# Altium schematic sheet Microcontroller.SchDoc
size 431 x 279 mm; ApprovedBy: UDEMY; CheckedBy: Siz Değerli Öğrenciler; Revision: AA; SheetNumber: 4; SheetTotal: 5; PreparedBy: Mustafa Berk AYDOĞAN; ProjectDescription: Wireless Security
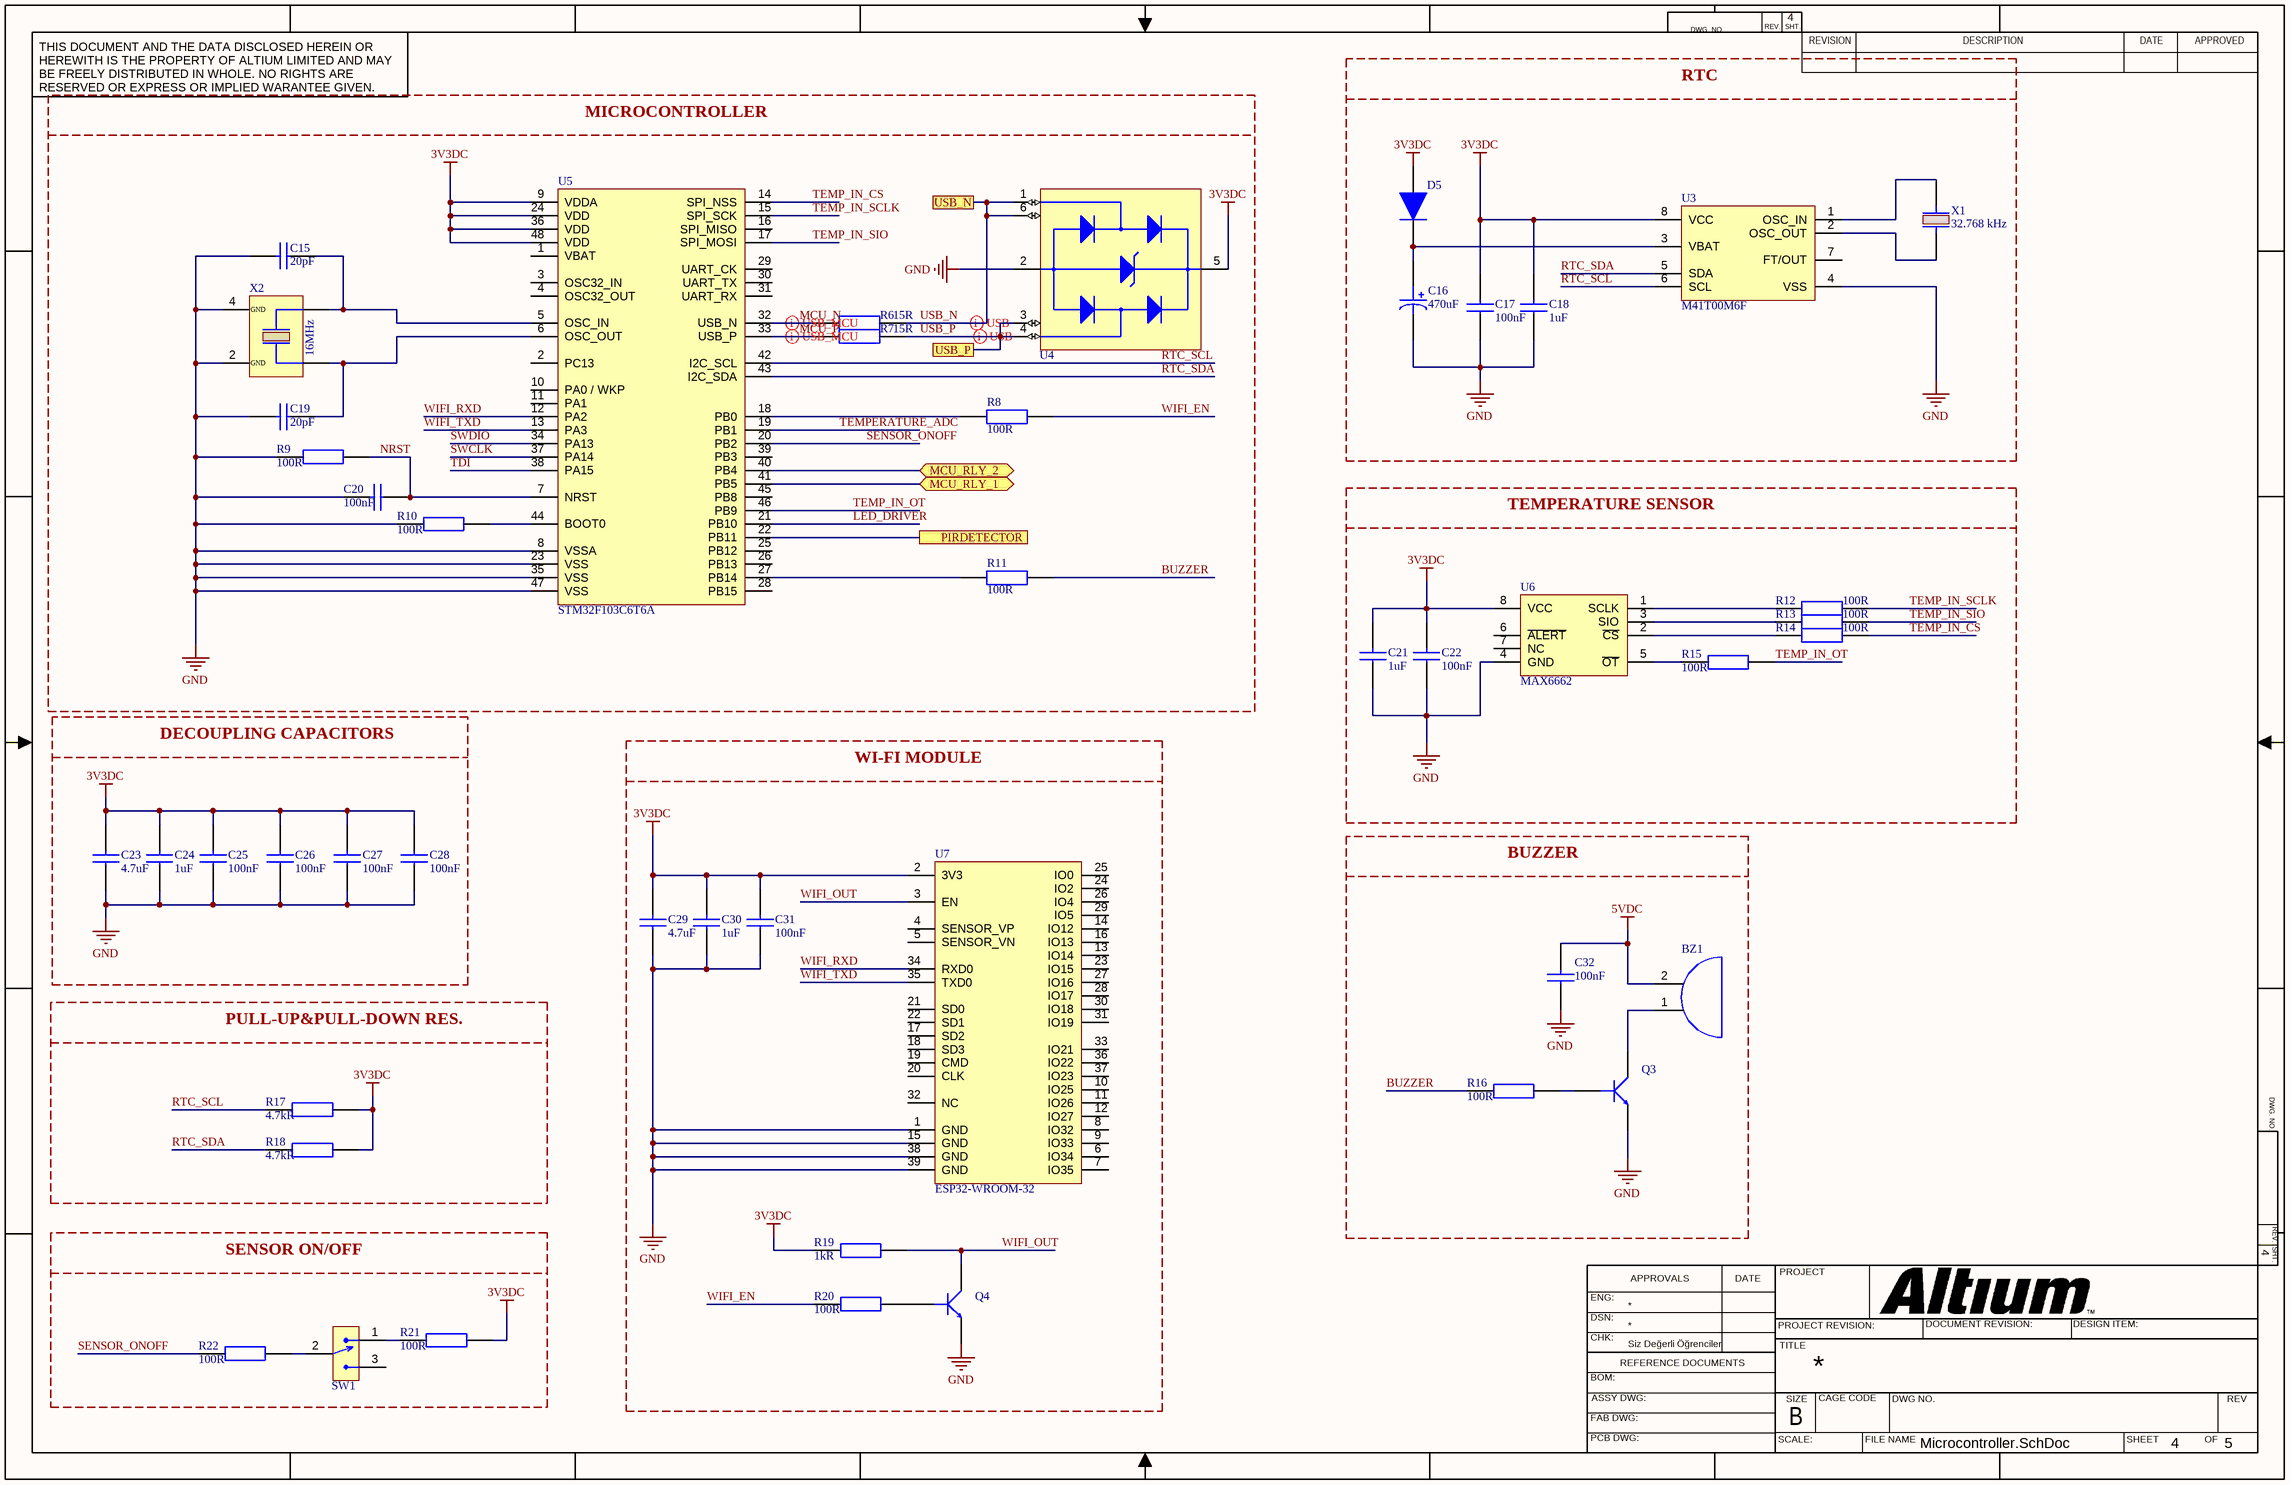
[diagram p0: Microcontroller.SchDoc]

## Parts
BZ1  CMI-9605IC-0580T  [CMI-9605IC]  (value not drawn)
C15  Capacitance: 20pF  [CAP_0603]  (hidden comment: CL10C200JB8NNNC)
C16  Capacitance: 470uF  [CAP_RADIAL_D10_P5]  (hidden comment: ESH477M050AH4AA)
C17  Capacitance: 100nF  [CAP_0805]  (hidden comment: CL21B104KBCNNNC)
C18  Capacitance: 1uF  [CAP_0805]  (hidden comment: CL21B105KBFNNNE)
C19  Capacitance: 20pF  [CAP_0603]  (hidden comment: CL10C200JB8NNNC)
C20  Capacitance: 100nF  [CAP_0603]  (hidden comment: C0603C104K5RACTU)
C21  Capacitance: 1uF  [CAP_0805]  (hidden comment: CL21B105KBFNNNE)
C22  Capacitance: 100nF  [CAP_0805]  (hidden comment: CL21B104KBCNNNC)
C23  Capacitance: 4.7uF  [CAP_0805]  (hidden comment: CL21A475KAQNNNE)
C24  Capacitance: 1uF  [CAP_0805]  (hidden comment: CL21B105KBFNNNE)
C25  Capacitance: 100nF  [CAP_0603]  (hidden comment: C0603C104K5RACTU)
C26  Capacitance: 100nF  [CAP_0603]  (hidden comment: C0603C104K5RACTU)
C27  Capacitance: 100nF  [CAP_0603]  (hidden comment: C0603C104K5RACTU)
C28  Capacitance: 100nF  [CAP_0603]  (hidden comment: C0603C104K5RACTU)
C29  Capacitance: 4.7uF  [CAP_0805]  (hidden comment: CL21A475KAQNNNE)
C30  Capacitance: 1uF  [CAP_0805]  (hidden comment: CL21B105KBFNNNE)
C31  Capacitance: 100nF  [CAP_0805]  (hidden comment: CL21B104KBCNNNC)
C32  Capacitance: 100nF  [CAP_0805]  (hidden comment: CL21B104KBCNNNC)
D5  1N4148WS  [SOD323F]  (value not drawn)
Q3  MMBT3904-7-F  [SOT-23F]  (value not drawn)
Q4  MMBT3904-7-F  [SOT-23F]  (value not drawn)
R6  Resistance: 15R  [RES_0603]  (hidden comment: RC0603JR-0715RL)
R7  Resistance: 15R  [RES_0603]  (hidden comment: RC0603JR-0715RL)
R8  Resistance: 100R  [RES_0603]  (hidden comment: RC0603JR-07100RL)
R9  Resistance: 100R  [RES_0603]  (hidden comment: RC0603JR-07100RL)
R10  Resistance: 100R  [RES_0603]  (hidden comment: RC0603JR-07100RL)
R11  Resistance: 100R  [RES_0603]  (hidden comment: RC0603JR-07100RL)
R12  Resistance: 100R  [RES_0603]  (hidden comment: RC0603JR-07100RL)
R13  Resistance: 100R  [RES_0603]  (hidden comment: RC0603JR-07100RL)
R14  Resistance: 100R  [RES_0603]  (hidden comment: RC0603JR-07100RL)
R15  Resistance: 100R  [RES_0603]  (hidden comment: RC0603JR-07100RL)
R16  Resistance: 100R  [RES_0603]  (hidden comment: RC0603JR-07100RL)
R17  Resistance: 4.7kR  [RES_0603]  (hidden comment: RC0603JR-074K7L)
R18  Resistance: 4.7kR  [RES_0603]  (hidden comment: RC0603JR-074K7L)
R19  Resistance: 1kR  [RES_0603]  (hidden comment: RC0603FR-0710KL)
R20  Resistance: 100R  [RES_0603]  (hidden comment: RC0603JR-07100RL)
R21  Resistance: 100R  [RES_0603]  (hidden comment: RC0603JR-07100RL)
R22  Resistance: 100R  [RES_0603]  (hidden comment: RC0603JR-07100RL)
SW1  EG1215AA  [EG1215AA]  (value not drawn)
U3  M41T00M6F  [SOIC8]
U4  USBLC6-2SC6  [SOT23-6L]  (value not drawn)
U5  STM32F103C6T6A  [LQFP-48]
U6  MAX6662  [SOIC8]
U7  ESP32-WROOM-32  [ESP32-32]
X1  Operating Frequency: 32.768 kHz  [ABS05]  (hidden comment: ABS05-32.768KHZ-T)
X2  Frequency: 16MHz  [ECS]  (hidden comment: ECS-160-20-30B-TR)

## Blocks framed on the sheet
MICROCONTROLLER: C15 C19 C20 R6-R11 U4 U5 X2
RTC: C16-C18 D5 U3 X1
TEMPERATURE SENSOR: C21 C22 R12-R15 U6
DECOUPLING CAPACITORS: C23-C28
WI-FI MODULE: C29-C31 Q4 R19 R20 U7
BUZZER: BZ1 C32 Q3 R16
PULL-UP&PULL-DOWN RES.: R17 R18
SENSOR ON/OFF: R21 R22 SW1

## Ports
MCU_RLY_1 (bidir), MCU_RLY_2 (bidir), PIRDETECTOR, USB_N, USB_P

## Nets
3V3DC: C17.2 C18.2 C21.2 C22.2 C23.2 C24.2 C25.2 C26.2 C27.2 C28.2 C29.2 C30.2 C31.2 D5.2 R17.2 R18.2 R19.2 R21.2 U3.8(VCC) U4.5(VBUS) U5.9(VDDA) U5.24(VDD) U5.36(VDD) U5.48(VDD) U6.8(VCC) U7.2(3V3)
5VDC: BZ1.2 C32.2
GND: C15.2 C16.2 C17.1 C18.1 C19.2 C20.2 C21.1 C22.1 C23.1 C24.1 C25.1 C26.1 C27.1 C28.1 C29.1 C30.1 C31.1 C32.1 Q3.2(E) Q4.2(E) R9.1 R10.1 U3.4(VSS) U4.2(GND) U5.8(VSSA) U5.23(VSS) U5.35(VSS) U5.47(VSS) U6.4(GND) U7.1(GND) U7.15(GND) U7.38(GND) U7.39(GND) X2.2(GND) X2.4(GND)
BUZZER: R11.2 R16.1
LED_DRIVER: U5.21(PB10)
MCU_N: R6.1 U5.32(USB_N)
MCU_P: R7.1 U5.33(USB_P)
MCU_RLY_1: U5.41(PB5) ; port MCU_RLY_1
MCU_RLY_2: U5.40(PB4) ; port MCU_RLY_2
NRST: C20.1 R9.2 U5.7(NRST)
PIRDETECTOR: U5.22(PB11) ; port PIRDETECTOR
RTC_SCL: R17.1 U3.6(SCL) U5.42(I2C_SCL)
RTC_SDA: R18.1 U3.5(SDA) U5.43(I2C_SDA)
SENSOR_ONOFF: R22.2 U5.20(PB2)
SWCLK: U5.37(PA14)
SWDIO: U5.34(PA13)
TDI: U5.38(PA15)
TEMP_IN_CS: R14.2 U5.14(SPI_NSS)
TEMP_IN_OT: R15.2 U5.46(PB9)
TEMP_IN_SCLK: R12.2 U5.15(SPI_SCK)
TEMP_IN_SIO: R13.2 U5.17(SPI_MOSI)
TEMPERATURE_ADC: U5.19(PB1)
USB_N: R6.2 U4.1(I/O1) U4.6(I/O1) ; port USB_N
USB_P: R7.2 U4.3(I/O2) U4.4(I/O2) ; port USB_P
WIFI_EN: R8.2 R20.1
WIFI_OUT: Q4.3(C) R19.1 U7.3(EN)
WIFI_RXD: U5.12(PA2) U7.34(RXD0)
WIFI_TXD: U5.13(PA3) U7.35(TXD0)
NetBZ1_1: BZ1.1 Q3.3(C)
NetC15_1: C15.1 U5.5(OSC_IN) X2.3
NetC16_1: C16.1 D5.1 U3.3(VBAT)
NetC19_1: C19.1 U5.6(OSC_OUT) X2.1
NetQ3_1: Q3.1(B) R16.2
NetQ4_1: Q4.1(B) R20.2
NetR8_1: R8.1 U5.18(PB0)
NetR10_2: R10.2 U5.44(BOOT0)
NetR11_1: R11.1 U5.27(PB14)
NetR12_1: R12.1 U6.1(SCLK)
NetR13_1: R13.1 U6.3(SIO)
NetR14_1: R14.1 U6.2(~{CS})
NetR15_1: R15.1 U6.5(~{OT})
NetR21_1: R21.1 SW1.1
NetR22_1: R22.1 SW1.2
NetU3_1: U3.1(OSC_IN) X1.2
NetU3_2: U3.2(OSC_OUT) X1.1

Not connected (* = marked no-connect by the designer): SW1 3; U3 7(FT/OUT); U5 1(VBAT) 2(PC13) 3(OSC32_IN) 4(OSC32_OUT) 10(PA0_/_WKP) 11(PA1) 16(SPI_MISO) 25(PB12) 26(PB13) 28(PB15) 29(UART_CK) 30(UART_TX) 31(UART_RX) 39(PB3) 45(PB8); U6 6(~{ALERT}) 7(NC); U7 4(SENSOR_VP) 5(SENSOR_VN) 6(IO34) 7(IO35) 8(IO32) 9(IO33) 10(IO25) 11(IO26) 12(IO27) 13(IO14) 14(IO12) 16(IO13) 17(SD2) 18(SD3) 19(CMD) 20(CLK) 21(SD0) 22(SD1) 23(IO15) 24(IO2) 25(IO0) 26(IO4) 27(IO16) 28(IO17) 29(IO5) 30(IO18) 31(IO19) 32(NC) 33(IO21) 36(IO22) 37(IO23)

## Layout directives
differential pair: MCU_N, MCU_P, USB_N, USB_P

## Notes on the sheet
- DWG. NO.
- REV.
- SHT.
- THIS DOCUMENT AND THE DATA DISCLOSED HEREIN OR HEREWITH IS THE PROPERTY OF ALTIUM LIMITED AND MAY BE FREELY DISTRIBUTED IN WHOLE. NO RIGHTS ARE RESERVED OR EXPRESS OR IMPLIED WARANTEE GIVEN.
- REVISION
- DESCRIPTION
- DATE
- APPROVED
- ENG:
- APPROVALS
- PROJECT
- DSN:
- CHK:
- REFERENCE DOCUMENTS
- PROJECT REVISION:
- TITLE
- DOCUMENT REVISION:
- DESIGN ITEM:
- BOM:
- FAB DWG:
- PCB DWG:
- ASSY DWG:
- SCALE:
- SIZE
- B
- CAGE CODE
- FILE NAME
- DWG NO.
- SHEET
- OF
- REV

## Library data of the parts
BZ1 = CMI-9605IC-0580T: Buzzers Indicator, Internally Driven Magnetic 5V 30mA 2.7kHz 80dB @ 5V, 10cm Through Hole PC Pins; Manufacturer: CUI Devices; Designed by: BERK; Supplier 1: Digi-Key; Manufacturer Part Number: CMI-9605IC-0580T; RoHS: No; Stock 1: 1663; Pricing 1: 1=1,41000, 10=1,17900, 25=1,09080, 50=1,02680, 100=0,96490, 500=0,83018, 1000=0,77805 (USD); Supplier Part Number 1: 2223-CMI-9605IC-0580T-ND; Case/Package: CMI-9605IC
C15 C19 = CAP CER 20pF 0603: CAP CER 20pF %5 0603 SMD; Manufacturer: Samsung; Tolerance: 5%; Dielectric: C0G; Voltage Rating: 50V; Temperature Coefficient: 300ppm/°C; Designed by: BERK; Supplier 1: Digi-Key; Manufacturer Part Number: CL10C200JB8NNNC; RoHS: Yes; Category: Ceramic Capacitors; Stock 1: 765558; Pricing 1: 1=0,10000, 10=0,04700, 50=0,02560, 100=0,02090, 500=0,01490, 1000=0,01171 (USD); Mount: Surface Mount; Case/Package: 0603; Case Code (Metric): 1608; Case Code (Imperial): 0603; Min Operating Temperature: -55°C; Max Operating Temperature: 125°C; Package Quantity: 1; Packaging: Tape and Reel; Voltage: 50V; Series: CL; Construction: Flat; Length: 1.6mm; Width: 0.031inch; Height: 0.8mm; Thickness: 0.035inch; Depth: 0.8mm; Radiation Hardening: No; RoHS Compliant: Yes; ComponentLink1URL: https://datasheet.ciiva.com/26877/getdatasheetpartid-640634-26877974.pdf?src-supplier=Verical; ComponentLink1Description: https://datasheet.ciiva.com/26877/getdatasheetpartid-640634-26877974.pdf?src-supplier=Verical; ComponentLink2URL: https://datasheet.ciiva.com/26310/mlcc-catalogdownload2013-eng-26310315.pdf?src-supplier=Distrelec; ComponentLink2Description: https://datasheet.ciiva.com/26310/mlcc-catalogdownload2013-eng-26310315.pdf?src-supplier=Distrelec; Supplier Part Number 1: 1276-1187-1-ND
C16 = CAP ALU ELEC 470uF 50V: CAP ALU ELEC 470uF 50V RADIAL; Manufacturer: KEMET; Designed by: BERK; Polarity: Polar; Tolerance: 20%; Life (Hours): 2000Hour; Supplier 1: Digi-Key; Manufacturer Part Number: ESH477M050AH4AA; RoHS: No; Stock 1: 1181; Pricing 1: 1=0,59000, 10=0,41700, 50=0,31540, 100=0,27470, 500=0,20350, 1000=0,17298, 2500=0,16280, 5000=0,15262 (USD); Mount: Through Hole; Case/Package: Radial; Min Operating Temperature: -40°C; Max Operating Temperature: 105°C; Packaging: Bulk; Voltage Rating: 50V; RoHS Compliant: No; ComponentLink1URL: https://api.kemet.com/component-edge/download/datasheet/ESH477M050AH4AA.pdf?src-supplier=Digi-Key; ComponentLink1Description: https://api.kemet.com/component-edge/download/datasheet/ESH477M050AH4AA.pdf?src-supplier=Digi-Key; Supplier Part Number 1: 399-15683-ND
C17 C22 C31 C32 = CAP CER 100nF 0805: CAP CER 100nF %10 0805; Manufacturer: Samsung; Designed by: BERK; Material: Ceramic; Tolerance: 10%; Dielectric: X7R; Voltage Rating: 50V; Supplier 1: Digi-Key; Manufacturer Part Number: CL21B104KBCNNNC; RoHS: Yes; Category: Ceramic Capacitors; Stock 1: 3371502; Pricing 1: 1=0,10000, 10=0,04700, 50=0,02560, 100=0,02090, 500=0,01494, 1000=0,01174 (USD); Mount: Surface Mount; Case/Package: 0805; Case Code (Metric): 2012; Case Code (Imperial): 0805; Contact Plating: Tin; Min Operating Temperature: -55°C; Max Operating Temperature: 125°C; Packaging: Tape and Reel; Voltage: 50V; Voltage Rating (DC): 50V; Series: CL; Construction: Flat; Length: 2mm; Width: 0.049inch; Height: 0.85mm; Depth: 1.25mm; Thickness: 0.037inch; Radiation Hardening: No; Lead Free: Lead Free; RoHS Compliant: Yes; ComponentLink1URL: https://datasheet.ciiva.com/25710/cl21b104kbcnnnc-25710182.pdf?src-supplier=Digi-Key; ComponentLink1Description: https://datasheet.ciiva.com/25710/cl21b104kbcnnnc-25710182.pdf?src-supplier=Digi-Key; ComponentLink2URL: https://datasheet.ciiva.com/29199/454152-da-01-en-vs-kondensator-0805-29199814.pdf?src-supplier=Conrad; ComponentLink2Description: https://datasheet.ciiva.com/29199/454152-da-01-en-vs-kondensator-0805-29199814.pdf?src-supplier=Conrad; Supplier Part Number 1: 1276-1003-1-ND
C18 C21 C24 C30 = CAP CER 1uF 0805: CAP CER 1uF %10 0805; Manufacturer: Samsung; Designed by: BERK; Tolerance: 10%; Voltage Rating: 50V; Dielectric: X7R; Supplier 1: Digi-Key; Manufacturer Part Number: CL21B105KBFNNNE; RoHS: Yes; Category: Ceramic Capacitors; Stock 1: 958000; Pricing 1: 2000=0,02138, 4000=0,01956 (USD); Mount: Surface Mount; Case/Package: 0805; Case Code (Metric): 2012; Case Code (Imperial): 0805; Min Operating Temperature: -55°C; Max Operating Temperature: 125°C; Packaging: Tape and Reel; Package Quantity: 1; Voltage: 50V; Series: CL; Construction: Flat; Length: 2mm; Width: 0.049inch; Height: 1.25mm; Thickness: 0.053inch; Depth: 1.25mm; Radiation Hardening: No; RoHS Compliant: Yes; ComponentLink1URL: https://datasheet.ciiva.com/25800/cl21b105kbfnnne-25800291.pdf?src-supplier=Digi-Key; ComponentLink1Description: https://datasheet.ciiva.com/25800/cl21b105kbfnnne-25800291.pdf?src-supplier=Digi-Key; ComponentLink2URL: https://datasheet.ciiva.com/16449/cl21b105kbfnnne-16449003.pdf?src-supplier=Future+Electronics; ComponentLink2Description: https://datasheet.ciiva.com/16449/cl21b105kbfnnne-16449003.pdf?src-supplier=Future+Electronics; ComponentLink3URL: https://datasheet.ciiva.com/26838/getdatasheetpartid-354075-26838668.pdf?src-supplier=Verical; ComponentLink3Description: https://datasheet.ciiva.com/26838/getdatasheetpartid-354075-26838668.pdf?src-supplier=Verical; Supplier Part Number 1: 1276-1029-2-ND
C20 C25-C28 = CAP CER 100nF 0603: CAP CER 100nF %10 0603 SMD; Manufacturer: KEMET; Designed by: BERK; Dielectric Material: Ceramic; Voltage Rating (DC): 50V; Tolerance: 10%; Dielectric: X7R; Dissipation Factor: 2.5%; Supplier 1: Digi-Key; Manufacturer Part Number: C0603C104K5RACTU; RoHS: Yes; Category: Ceramic Capacitors; Stock 1: 1666186; Pricing 1: 1=0,12000, 10=0,08500, 50=0,04620, 100=0,03770, 500=0,02696, 1000=0,02118 (USD); Mount: Surface Mount; Case/Package: 0603; Number of Pins: 2; Case Code (Metric): 1608; Case Code (Imperial): 0603; Contact Plating: Tin,Matte; Min Operating Temperature: -55°C; Max Operating Temperature: 125°C; Packaging: Tape and Reel; Package Quantity: 1; Termination: SMD/SMT; Voltage: 50V; Voltage Rating: 50V; Series: SMD Comm X7R; Length: 0.063inch; Width: 0.031inch; Height: 0.8mm; Thickness: 0.034inch; Lead Pitch: 0.7mm; Depth: 0.8mm; Radiation Hardening: No; RoHS Compliant: Yes; REACH SVHC: No SVHC; ComponentLink1URL: https://datasheet.ciiva.com/7823/kem-c1002-x7r-smd-7823591.pdf?src-supplier=Element14; ComponentLink1Description: https://datasheet.ciiva.com/7823/kem-c1002-x7r-smd-7823591.pdf?src-supplier=Element14; ComponentLink2URL: https://datasheet.ciiva.com/14602/70095383-14602583.pdf?src-supplier=Allied+Electronics; ComponentLink2Description: https://datasheet.ciiva.com/14602/70095383-14602583.pdf?src-supplier=Allied+Electronics; ComponentLink3URL: https://datasheet.ciiva.com/5999/kem-c1002-x7r-smd-5999400.pdf?src-supplier=Farnell; ComponentLink3Description: https://datasheet.ciiva.com/5999/kem-c1002-x7r-smd-5999400.pdf?src-supplier=Farnell; ComponentLink4URL: https://datasheet.ciiva.com/7823/kem-c1002-x7r-smd-7823592.pdf?src-supplier=Element14; ComponentLink4Description: https://datasheet.ciiva.com/7823/kem-c1002-x7r-smd-7823592.pdf?src-supplier=Element14; ComponentLink5URL: https://datasheet.ciiva.com/28645/1851736-28645640.pdf?src-supplier=Element14; ComponentLink5Description: https://datasheet.ciiva.com/28645/1851736-28645640.pdf?src-supplier=Element14; ComponentLink6URL: https://datasheet.ciiva.com/14585/70095383-14585209.pdf?src-supplier=Allied+Electronics; ComponentLink6Description: https://datasheet.ciiva.com/14585/70095383-14585209.pdf?src-supplier=Allied+Electronics; Supplier Part Number 1: 399-5089-1-ND
C23 C29 = CAP CER 4.7uF 0805: CAP CER 4.7uF %10 0805; Manufacturer: Samsung; Tolerance: 10%; Voltage Rating: 25V; Dielectric: X5R; Designed by: BERK; Supplier 1: Digi-Key; Manufacturer Part Number: CL21A475KAQNNNE; RoHS: Yes; Category: Ceramic Capacitors; Stock 1: 1477018; Pricing 1: 1=0,11000, 10=0,08100, 50=0,04580, 100=0,03800, 500=0,02664, 1000=0,02205 (USD); Mount: Surface Mount; Case/Package: 0805; Case Code (Metric): 2012; Case Code (Imperial): 0805; Min Operating Temperature: -55°C; Max Operating Temperature: 85°C; Package Quantity: 1; Packaging: Tape and Reel; Voltage Rating (DC): 25V; Series: CL; Construction: Flat; Length: 2mm; Width: 0.049inch; Height: 1.25mm; Thickness: 0.055inch; Depth: 1.25mm; Radiation Hardening: No; Lead Free: Lead Free; RoHS Compliant: Yes; ComponentLink1URL: https://datasheet.ciiva.com/25798/cl21a475kaqnnne-25798882.pdf?src-supplier=Digi-Key; ComponentLink1Description: https://datasheet.ciiva.com/25798/cl21a475kaqnnne-25798882.pdf?src-supplier=Digi-Key; Supplier Part Number 1: 1276-1244-1-ND
D5 = 1N4148WS: Diode, Single, 75 V, 150 mA, 1 V, 4 ns; Manufacturer: ON Semiconductor / Fairchild; Designed by: BERK; Forward Current: 150mA; Reverse Recovery Time: 4ns; Max Repetitive Reverse Voltage (Vrrm): 75V; Power Dissipation: 200mW; Max Reverse Current: 5uA; Forward Voltage: 1V; Max Forward Surge Current (Ifsm): 2A; Supplier 1: Digi-Key; Manufacturer Part Number: 1N4148WS; RoHS: Yes; Category: Rectifier Diodes; Stock 1: 79118; Pricing 1: 1=0,17000, 10=0,12100, 100=0,06530, 500=0,05128, 1000=0,03562 (USD); Mount: Surface Mount; Number of Pins: 2; Contact Plating: Tin,Matte; Weight: 0.0276g; Min Operating Temperature: -55°C; Max Operating Temperature: 150°C; Packaging: Tape and Reel; Package Quantity: 1; Recovery Time: 4ns; Average Rectified Current: 150mA; Element Configuration: Single; Reverse Voltage: 75V; Max Reverse Voltage (DC): 75V; Series: -; Length: 1.8mm; Width: 1.35mm; Height: 1mm; Radiation Hardening: No; REACH SVHC: No SVHC; Lead Free: Lead Free; RoHS Compliant: Yes; ComponentLink1URL: https://datasheet.ciiva.com/25968/1n914bws-25968945.pdf?src-supplier=Avnet+Europe; ComponentLink1Description: https://datasheet.ciiva.com/25968/1n914bws-25968945.pdf?src-supplier=Avnet+Europe; ComponentLink2URL: https://datasheet.ciiva.com/30479/0900766b810e1cd3-30479206.pdf?src-supplier=RSComponents; ComponentLink2Description: https://datasheet.ciiva.com/30479/0900766b810e1cd3-30479206.pdf?src-supplier=RSComponents; ComponentLink3URL: https://datasheet.ciiva.com/910/1n4148ws-910381.pdf?src-supplier=Digi-Key; ComponentLink3Description: https://datasheet.ciiva.com/910/1n4148ws-910381.pdf?src-supplier=Digi-Key; ComponentLink4URL: https://datasheet.ciiva.com/15208/getdatasheetpartid-127819-15208358.pdf?src-supplier=Verical; ComponentLink4Description: https://datasheet.ciiva.com/15208/getdatasheetpartid-127819-15208358.pdf?src-supplier=Verical; ComponentLink5URL: https://datasheet.ciiva.com/8300/1n914bws-8300360.pdf?src-supplier=Avnet; ComponentLink5Description: https://datasheet.ciiva.com/8300/1n914bws-8300360.pdf?src-supplier=Avnet; ComponentLink6URL: https://datasheet.ciiva.com/910/1n4148ws-910380.pdf?src-supplier=Digi-Key; ComponentLink6Description: https://datasheet.ciiva.com/910/1n4148ws-910380.pdf?src-supplier=Digi-Key; ComponentLink7URL: https://datasheet.ciiva.com/910/1n4148ws-910382.pdf?src-supplier=Digi-Key; ComponentLink7Description: https://datasheet.ciiva.com/910/1n4148ws-910382.pdf?src-supplier=Digi-Key; Supplier Part Number 1: 1N4148WSFSCT-ND
Q3 Q4 = MMBT3904-7-F: Transistor General Purpose BJT NPN 40 Volt 0.2A Automotive 3-Pin SOT-23; Manufacturer: Diodes Zetex; Designed by: BERK; Max Power Dissipation: 300mW; Collector Emitter Voltage (VCEO): 40V; Max Collector Current: 200mA; Collector Base Voltage (VCBO): 60V; Frequency: 300MHz; hFE Min: 100; Number of Elements: 1; Emitter Base Voltage (VEBO): 6V; Collector Emitter Saturation Voltage: 300mV; Power Dissipation: 350mW; Element Configuration: Single; Supplier 1: Digi-Key; Manufacturer Part Number: MMBT3904-7-F; RoHS: Yes; Category: BJTs; Stock 1: 2393281; Pricing 1: 1=0,12000, 10=0,08600, 25=0,08280, 100=0,04660, 500=0,03664, 1000=0,02544 (USD); Mount: Surface Mount; Case/Package: SOT-23; Number of Pins: 3; Weight: 0.000282oz; Contact Plating: Tin,Matte; Min Operating Temperature: -55°C; Max Operating Temperature: 150°C; Polarity: NPN; Packaging: Tape and Reel; Package Quantity: 3000; Transition Frequency: 300MHz; Collector Emitter Breakdown Voltage: 40V; Max Breakdown Voltage: 40V; Continuous Collector Current: 200mA; Max Frequency: 300MHz; Gain Bandwidth Product: 300MHz; Series: -; Collector-emitter Voltage-Max: 300mV; Voltage Rating (DC): 40V; Length: 3.05mm; Width: 1.4mm; Height: 1mm; Radiation Hardening: No; REACH SVHC: No SVHC; Lead Free: Lead Free; RoHS Compliant: Yes; ComponentLink1URL: https://datasheet.ciiva.com/11201/ds30036-11201778.pdf?src-supplier=Avnet; ComponentLink1Description: https://datasheet.ciiva.com/11201/ds30036-11201778.pdf?src-supplier=Avnet; ComponentLink2URL: https://datasheet.ciiva.com/15138/getdatasheetpartid-53265-15138780.pdf?src-supplier=Verical; ComponentLink2Description: https://datasheet.ciiva.com/15138/getdatasheetpartid-53265-15138780.pdf?src-supplier=Verical; ComponentLink3URL: https://datasheet.ciiva.com/6361/ds30036-6361254.pdf?src-supplier=Digi-Key; ComponentLink3Description: https://datasheet.ciiva.com/6361/ds30036-6361254.pdf?src-supplier=Digi-Key; ComponentLink4URL: https://datasheet.ciiva.com/22711/1915516-22711750.pdf?src-supplier=Element14; ComponentLink4Description: https://datasheet.ciiva.com/22711/1915516-22711750.pdf?src-supplier=Element14; ComponentLink5URL: https://datasheet.ciiva.com/11198/ds30036-11198999.pdf?src-supplier=Avnet; ComponentLink5Description: https://datasheet.ciiva.com/11198/ds30036-11198999.pdf?src-supplier=Avnet; ComponentLink6URL: https://datasheet.ciiva.com/6361/ds30036-6361256.pdf?src-supplier=Digi-Key; ComponentLink6Description: https://datasheet.ciiva.com/6361/ds30036-6361256.pdf?src-supplier=Digi-Key; Supplier Part Number 1: MMBT3904-FDIDKR-ND
R6 R7 = RES 15 OHM 0603: RES 15 %5 OHM 0603 SMD; Manufacturer: Yageo; Tolerance: 5%; Temperature Coefficient: 100ppm/°C; Voltage Rating (DC): 50V; Power Rating: 100mW; Voltage Rating: 75V; Designed by: BERK; Supplier 1: Digi-Key; Manufacturer Part Number: RC0603JR-0715RL; RoHS: Yes; Category: Chip SMD Resistors; Stock 1: 1720; Pricing 1: 1=0,10000, 10=0,01900, 100=0,00770, 1000=0,00344, 2500=0,00298 (USD); Case/Package: 0603; Number of Pins: 2; Case Code (Imperial): 0603; Case Code (Metric): 1608; Weight: 7.1E-05oz; Min Operating Temperature: -55°C; Max Operating Temperature: 155°C; Resistor Type: Thick Film; Packaging: Tape and Reel; Package Quantity: 1; Termination: SMD/SMT; Number of Terminations: 2; Max Power Dissipation: 100mW; Working Voltage: 75V; Features: Moisture Resistant; Series: RC; Resistance Tolerance: 5%; Construction: Rectangular; Length: 1.6mm; Width: 0.8mm; Height: 0.022inch; Depth: 0.8mm; REACH SVHC: No SVHC; Lead Free: Lead Free; Military Standard: Not; RoHS Compliant: Yes; ComponentLink1URL: https://datasheet.ciiva.com/2453/pyu-r-int-thick-7-2453085.pdf?src-supplier=Digi-Key; ComponentLink1Description: https://datasheet.ciiva.com/2453/pyu-r-int-thick-7-2453085.pdf?src-supplier=Digi-Key; ComponentLink2URL: https://datasheet.ciiva.com/7746/443971-7746445.pdf?src-supplier=Element14; ComponentLink2Description: https://datasheet.ciiva.com/7746/443971-7746445.pdf?src-supplier=Element14; ComponentLink3URL: https://datasheet.ciiva.com/2453/pyu-r-int-thick-7-2453086.pdf?src-supplier=Digi-Key; ComponentLink3Description: https://datasheet.ciiva.com/2453/pyu-r-int-thick-7-2453086.pdf?src-supplier=Digi-Key; ComponentLink4URL: https://datasheet.ciiva.com/7746/443971-7746446.pdf?src-supplier=Element14; ComponentLink4Description: https://datasheet.ciiva.com/7746/443971-7746446.pdf?src-supplier=Element14; ComponentLink5URL: https://datasheet.ciiva.com/2453/pyu-r-int-thick-7-2453087.pdf?src-supplier=Digi-Key; ComponentLink5Description: https://datasheet.ciiva.com/2453/pyu-r-int-thick-7-2453087.pdf?src-supplier=Digi-Key; Supplier Part Number 1: 311-15GRCT-ND
R8-R16 R20-R22 = RES 100 OHM 0603: RES 100 %5 OHM 0603 SMD; Manufacturer: Yageo; Designed by: BERK; Tolerance: 5%; Temperature Coefficient: 100ppm/°C; Voltage Rating (DC): 50V; Power Rating: 100mW; Supplier 1: Digi-Key; Manufacturer Part Number: RC0603JR-07100RL; RoHS: Yes; Category: Chip SMD Resistors; Stock 1: 4334796; Pricing 1: 1=0,10000, 10=0,01900, 100=0,00770, 1000=0,00344, 2500=0,00298 (USD); Case/Package: 0603; Number of Pins: 2; Contact Plating: Tin,Matte; Case Code (Imperial): 0603; Case Code (Metric): 1608; Size Code: 0603; Min Operating Temperature: -55°C; Max Operating Temperature: 155°C; Resistor Type: Thick Film; Packaging: Tape and Reel; Voltage Rating: 50V; Termination: SMD/SMT; Features: Moisture Resistant; Series: RC; Max Power Dissipation: 100mW; Number of Terminations: 2; Construction: Rectangular; Resistance Tolerance: 5%; Length: 1.6mm; Width: 0.8mm; Depth: 0.8mm; Radiation Hardening: No; REACH SVHC: Unknown; Lead Free: Lead Free; Military Standard: Not; RoHS Compliant: Yes; ComponentLink1URL: https://datasheet.ciiva.com/15189/getdatasheetpartid-325207-15189846.pdf?src-supplier=Verical; ComponentLink1Description: https://datasheet.ciiva.com/15189/getdatasheetpartid-325207-15189846.pdf?src-supplier=Verical; ComponentLink2URL: https://datasheet.ciiva.com/8883/pyu-rc0603-51-rohs-l-4-8883047.pdf?src-supplier=Avnet; ComponentLink2Description: https://datasheet.ciiva.com/8883/pyu-rc0603-51-rohs-l-4-8883047.pdf?src-supplier=Avnet; ComponentLink3URL: https://datasheet.ciiva.com/7746/443971-7746425.pdf?src-supplier=Element14; ComponentLink3Description: https://datasheet.ciiva.com/7746/443971-7746425.pdf?src-supplier=Element14; ComponentLink4URL: https://datasheet.ciiva.com/7746/443971-7746426.pdf?src-supplier=Element14; ComponentLink4Description: https://datasheet.ciiva.com/7746/443971-7746426.pdf?src-supplier=Element14; Supplier Part Number 1: 311-100GRCT-ND
R17 R18 = RES 4K7 OHM 0603: RES 4K7 %5 OHM 0603 SMD; Manufacturer: Yageo; Tolerance: 5%; Temperature Coefficient: 100ppm/°C; Voltage Rating (DC): 50V; Power Rating: 100mW; Designed by: BERK; Supplier 1: Digi-Key; Manufacturer Part Number: RC0603JR-074K7L; RoHS: Yes; Category: Chip SMD Resistors; Stock 1: 3901839; Pricing 1: 1=0,10000, 10=0,01900, 100=0,00770, 1000=0,00344, 2500=0,00298 (USD); Case/Package: 0603; Number of Pins: 2; Case Code (Imperial): 0603; Case Code (Metric): 1608; Size Code: 0603; Min Operating Temperature: -55°C; Max Operating Temperature: 155°C; Resistor Type: Thick Film; Packaging: Tape and Reel; Voltage Rating: 50V; Termination: SMD/SMT; Features: Moisture Resistant; Max Power Dissipation: 100mW; Number of Terminations: 2; Series: RC; Resistance Tolerance: 5%; Construction: Rectangular; Length: 1.6mm; Width: 0.8mm; Depth: 0.8mm; REACH SVHC: No SVHC; Lead Free: Lead Free; RoHS Compliant: Yes; Military Standard: Not; ComponentLink1URL: https://datasheet.ciiva.com/46412/443971-46412858.pdf?src-supplier=Element14; ComponentLink1Description: https://datasheet.ciiva.com/46412/443971-46412858.pdf?src-supplier=Element14; Supplier Part Number 1: 311-4.7KGRCT-ND
R19 = RES 1K OHM 0603: RES 1K %1 OHM 0603 SMD; Manufacturer: Yageo; Manufacturer Part Number: RC0603JR-071KL; Designed by: BERK; Tolerance: 5%; Temperature Coefficient: 100ppm/°C; Voltage Rating (DC): 50V; Power Rating: 100mW; Body Length: 1.6mm; Supplier 1: Digi-Key; RoHS: Yes; Category: Chip SMD Resistors; Stock 1: 5112056; Pricing 1: 1=0,10000, 10=0,01900, 100=0,00770, 1000=0,00344, 2500=0,00298 (USD); Case/Package: 0603; Number of Pins: 2; Contact Plating: Tin,Matte; Case Code (Imperial): 0603; Case Code (Metric): 1608; Size Code: 0603; Min Operating Temperature: -55°C; Max Operating Temperature: 155°C; Resistor Type: Thick Film; Packaging: Tape and Reel; Package Quantity: 5000; Voltage Rating: 50V; Termination: SMD/SMT; Series: RC; Resistance Tolerance: 5%; Construction: Rectangular; Length: 1.6mm; Width: 0.8mm; Height: 0.45mm; Depth: 0.8mm; Radiation Hardening: No; REACH SVHC: Unknown; Lead Free: Lead Free; Military Standard: Not; RoHS Compliant: Yes; ComponentLink1URL: https://datasheet.ciiva.com/8883/pyu-rc0603-51-rohs-l-4-8883051.pdf?src-supplier=Avnet; ComponentLink1Description: https://datasheet.ciiva.com/8883/pyu-rc0603-51-rohs-l-4-8883051.pdf?src-supplier=Avnet; ComponentLink2URL: https://datasheet.ciiva.com/7746/443971-7746461.pdf?src-supplier=Element14; ComponentLink2Description: https://datasheet.ciiva.com/7746/443971-7746461.pdf?src-supplier=Element14; ComponentLink3URL: https://datasheet.ciiva.com/22747/443971-22747533.pdf?src-supplier=Element14; ComponentLink3Description: https://datasheet.ciiva.com/22747/443971-22747533.pdf?src-supplier=Element14; ComponentLink4URL: https://datasheet.ciiva.com/7746/443971-7746462.pdf?src-supplier=Element14; ComponentLink4Description: https://datasheet.ciiva.com/7746/443971-7746462.pdf?src-supplier=Element14; Supplier Part Number 1: 311-1.0KGRCT-ND
SW1 = EG1215AA: Slide Switch, SPDT, 0.025A, 24V, SMD; Manufacturer: E-Switch; Designed by: BERK; Mechanical Life: 10000Cycles; Switch Function: On-On; Current Rating: 25mA; Actuator Type: Standard; Switch Travel: 1.5mm; Operating Force: 150gf; Zener Voltage: 9.1V; Tolerance: 4.95%; Max Power Dissipation: 5W; Impedance: 2R; Actuator Length: 1.4mm; Supplier 1: Digi-Key; Manufacturer Part Number: EG1215AA; RoHS: No; Stock 1: 6245; Pricing 1: 1=0,85000, 10=0,81900, 25=0,76560, 100=0,66470, 250=0,60480, 500=0,56070, 1000=0,51975 (USD); Mount: Surface Mount,Through Hole; Case/Package: Axial; Min Operating Temperature: -20°C; Max Operating Temperature: 175°C; Throw Configuration: SPDT; Packaging: Cut Tape; Voltage Rating (DC): 24V; Termination: Gull Wing; Electrical Life: 10000Cycles; ComponentLink1URL: https://media.digikey.com/pdf/Data%20Sheets/E-Switch%20PDFs/EG1215_Series_Ds.pdf?src-supplier=Digi-Key; ComponentLink1Description: https://media.digikey.com/pdf/Data%20Sheets/E-Switch%20PDFs/EG1215_Series_Ds.pdf?src-supplier=Digi-Key; ComponentLink2URL: http://www.farnell.com/datasheets/2645007.pdf?src-supplier=Farnell; ComponentLink2Description: http://www.farnell.com/datasheets/2645007.pdf?src-supplier=Farnell; Supplier Part Number 1: EG5720CT-ND
U3 = M41T00M6F: IC RTC CLK/CALENDAR I2C 8-SOIC; Manufacturer: STMicroelectronics; Designed by: BERK; Logic Function: Clock; Time Format: HH:MM:SS; Max Supply Voltage: 5.5V; Min Supply Voltage: 2V; Non-volatile Memory Size: 8B; Interface: I2C,Serial,2-Wire; Date Format: YY-MM-DD-dd; Supplier 1: Digi-Key; Manufacturer Part Number: M41T00M6F; RoHS: Yes; Category: Memory; Stock 1: 13199; Pricing 1: 1=2,81000, 10=2,52200, 25=2,37960, 100=2,02750, 250=1,90376, 500=1,79600 (USD); Mount: Surface Mount; Case/Package: SOIC; Number of Pins: 8; Weight: 0.019048oz; Min Operating Temperature: -40°C; Max Operating Temperature: 85°C; Packaging: Tape and Reel; Package Quantity: 2500; Memory Size: 8B; RAM Size: 8B; Series: M41T00; Supply Voltage-Nom: 5.5V; Length: 5mm; Width: 4mm; Height: 1.5mm; Radiation Hardening: No; REACH SVHC: No SVHC; Lead Free: Lead Free; Temperature Grade: INDUSTRIAL; RoHS Compliant: Yes; ComponentLink1URL: https://datasheet.ciiva.com/25889/cd00001542-25889923.pdf?src-supplier=Avnet+Europe; ComponentLink1Description: https://datasheet.ciiva.com/25889/cd00001542-25889923.pdf?src-supplier=Avnet+Europe; ComponentLink2URL: https://datasheet.ciiva.com/16213/cd00001542-16213654.pdf?src-supplier=Future+Electronics; ComponentLink2Description: https://datasheet.ciiva.com/16213/cd00001542-16213654.pdf?src-supplier=Future+Electronics; ComponentLink3URL: https://datasheet.ciiva.com/7630/1837112-7630077.pdf?src-supplier=Element14; ComponentLink3Description: https://datasheet.ciiva.com/7630/1837112-7630077.pdf?src-supplier=Element14; ComponentLink4URL: https://datasheet.ciiva.com/41459/001185345-da-01-en-ic-rtc-srl-512kbit-m41t00m6f-soic-8-stm-41459818.pdf?src-supplier=Conrad; ComponentLink4Description: https://datasheet.ciiva.com/41459/001185345-da-01-en-ic-rtc-srl-512kbit-m41t00m6f-soic-8-stm-41459818.pdf?src-supplier=Conrad; Supplier Part Number 1: 497-4697-1-ND
U4 = USB PROTECTION: TVS DIODE 5.25V 17V SOT23-6; Manufacturer: STMicroelectronics; Designed by: BERK; Direction: Unidirectional,Bidirectional; Capacitance: 3.5pF; Operating Supply Voltage: 1.1V; Number of Channels: 2; Breakdown Voltage: 6V; Power Line Protection: Yes; Test Current: 1mA; Max Reverse Leakage Current: 150nA; Peak Pulse Current: 5A; Element Configuration: Dual; Data Rate: 480Mbps; Number of Elements: 1; Working Voltage: 5V; Supplier 1: Digi-Key; Manufacturer Part Number: USBLC6-2SC6; RoHS: Yes; Category: TVS Diodes; Stock 1: 112981; Pricing 1: 1=0,50000, 10=0,43100, 100=0,29930, 500=0,23368, 1000=0,19005 (USD); Mount: Surface Mount; Case/Package: SOT-23; Number of Pins: 6; Contact Plating: Tin,Matte; Min Operating Temperature: -40°C; Max Operating Temperature: 125°C; Clamping Voltage: 17V; Packaging: Tape and Reel; Package Quantity: 3000; Termination: SMD/SMT; Number of Bidirectional Channels: 2; Reverse Standoff Voltage: 5.25V; Min Breakdown Voltage: 6V; ESD Protection: Yes; Leakage Current: 150nA; Series: USB; Reverse Breakdown Voltage: 6V; Polarity: Unidirectional,Bidirectional; Max Breakdown Voltage: 6V; Clamping Voltage-Max: 17V; Length: 3.05mm; Width: 1.75mm; Height: 1.3mm; Depth: 1.75mm; Radiation Hardening: No; REACH SVHC: No SVHC; Lead Free: Lead Free; RoHS Compliant: Yes; ComponentLink1URL: https://datasheet.ciiva.com/1268/1690354-1268384.pdf?src-supplier=Element14; ComponentLink1Description: https://datasheet.ciiva.com/1268/1690354-1268384.pdf?src-supplier=Element14; ComponentLink2URL: https://datasheet.ciiva.com/4508/cd00050750-113117-4508433.pdf?src-supplier=Mouser; ComponentLink2Description: https://datasheet.ciiva.com/4508/cd00050750-113117-4508433.pdf?src-supplier=Mouser; ComponentLink3URL: https://datasheet.ciiva.com/15143/getdatasheetpartid-148465-15143789.pdf?src-supplier=Verical; ComponentLink3Description: https://datasheet.ciiva.com/15143/getdatasheetpartid-148465-15143789.pdf?src-supplier=Verical; ComponentLink4URL: https://datasheet.ciiva.com/26787/usblc6-2sc6-26787908.pdf?src-supplier=IIIC; ComponentLink4Description: https://datasheet.ciiva.com/26787/usblc6-2sc6-26787908.pdf?src-supplier=IIIC; ComponentLink5URL: https://datasheet.ciiva.com/16200/cd00050750-16200026.pdf?src-supplier=Future+Electronics; ComponentLink5Description: https://datasheet.ciiva.com/16200/cd00050750-16200026.pdf?src-supplier=Future+Electronics; ComponentLink6URL: https://datasheet.ciiva.com/41444/001184109-da-01-en-ic-esd-protecti-usblc6-2sc6-sot-23-6-stm-41444156.pdf?src-supplier=Conrad; ComponentLink6Description: https://datasheet.ciiva.com/41444/001184109-da-01-en-ic-esd-protecti-usblc6-2sc6-sot-23-6-stm-41444156.pdf?src-supplier=Conrad; Supplier Part Number 1: 497-5235-1-ND
U5 = STM32F103C6T6A: MCU 32-bit STM32F ARM Cortex M3 RISC 32KB Flash 2.5V/3.3V 48-Pin LQFP Tray; Manufacturer: STMicroelectronics; Number of Timers/Counters: 3; Max Supply Voltage: 3.6V; Frequency: 72MHz; Interface: I2C,SPI,USART; RAM Size: 10KB; Max Power Dissipation: 363mW; Number of I/Os: 37; Min Supply Voltage: 2V; Oscillator Type: Internal; Data Bus Width: 32b; Watchdog Timer: Yes; Peripherals: POR,PWM,WDT,DMA,Temp Sensor,I2C; Number of ADC Channels: 10; Number of SPI Channels: 1; Designed by: BERK; SleepMode: OK; Supplier 1: Digi-Key; Manufacturer Part Number: STM32F103C6T6A; RoHS: Yes; Category: Microcontrollers; Stock 1: 30; Pricing 1: 1=5,07000, 10=4,55000, 25=4,30120, 80=3,72763, 250=3,53648, 500=3,18600 (USD); Case/Package: LQFP; Number of Pins: 48; Weight: 0.006409oz; Min Operating Temperature: -40°C; Max Operating Temperature: 85°C; Package Quantity: 1500; Packaging: Tray; Max Frequency: 72MHz; Number of Programmable I/O: 37; Memory Type: FLASH; Memory Size: 32KB; Core Architecture: ARM; Series: STM32F103C6; Number of I2C Channels: 1; Address Bus Width: 32b; Length: 7mm; Width: 7mm; Height: 1.4mm; Radiation Hardening: No; Lead Free: Lead Free; REACH SVHC: No SVHC; RoHS Compliant: Yes; ComponentLink1URL: https://datasheet.ciiva.com/15122/getdatasheetpartid-69879-15122075.pdf?src-supplier=Verical; ComponentLink1Description: https://datasheet.ciiva.com/15122/getdatasheetpartid-69879-15122075.pdf?src-supplier=Verical; ComponentLink2URL: https://datasheet.ciiva.com/14100/pustm-arm-microcont-stm32f103-en-14100507.pdf?src-supplier=Distrelec; ComponentLink2Description: https://datasheet.ciiva.com/14100/pustm-arm-microcont-stm32f103-en-14100507.pdf?src-supplier=Distrelec; Supplier 2: Avnet; Stock 2: 2360; Pricing 2: 250=1,99138, 260=1,95951, 510=1,91172, 1300=1,87986, 2500=1,84800, 13000=1,81613, 25000=1,78427 (USD); Supplier Part Number 1: 497-11515-ND; Supplier Part Number 2: STM32F103C6T6A
U6 = MAX6662: SENSOR TEMPERATURE SPI 8SOIC; Manufacturer: Maxim; Manufacturer Part Number: MAX6662MSA+; Designed by: BERK; Output Type: Digital,SPI; Max Supply Voltage (DC): 5.5V; Min Supply Voltage (DC): 3V; Resolution: 12b; Operating Supply Current: 600uA; Max Power Dissipation: 471mW; Number of Bits: 12; Supplier 1: Digi-Key; RoHS: Yes; Category: Temperature and Humidity Sensors; Stock 1: 753; Pricing 1: 1=3,20000, 10=2,87000, 25=2,71360, 100=2,35170, 500=2,00196, 1000=1,68840, 5000=1,64820 (USD); Case/Package: SOIC; Number of Pins: 8; Min Operating Temperature: -55°C; Max Operating Temperature: 150°C; Interface: SPI; Packaging: Rail/Tube; Package Quantity: 100; Series: MAX6662; Max Supply Voltage: 5.5V; Min Supply Voltage: 3V; Length: 5mm; Width: 4mm; Height: 1.5mm; Radiation Hardening: No; RoHS Compliant: Yes; Lead Free: Lead Free; REACH SVHC: Unknown; ComponentLink1URL: https://datasheet.ciiva.com/5299/max6662-89142-5299456.pdf?src-supplier=Mouser; ComponentLink1Description: https://datasheet.ciiva.com/5299/max6662-89142-5299456.pdf?src-supplier=Mouser; ComponentLink2URL: https://datasheet.ciiva.com/16635/max6662-16635842.pdf?src-supplier=Avnet+Europe; ComponentLink2Description: https://datasheet.ciiva.com/16635/max6662-16635842.pdf?src-supplier=Avnet+Europe; ComponentLink3URL: https://datasheet.ciiva.com/3277/max6662-3277979.pdf?src-supplier=Avnet; ComponentLink3Description: https://datasheet.ciiva.com/3277/max6662-3277979.pdf?src-supplier=Avnet; ComponentLink4URL: https://datasheet.ciiva.com/2003/max6662-2003390.pdf?src-supplier=Digi-Key; ComponentLink4Description: https://datasheet.ciiva.com/2003/max6662-2003390.pdf?src-supplier=Digi-Key; Supplier Part Number 1: MAX6662MSA+-ND
U7 = ESP32-WROOM-32: SMD MODULE, ESP32-D0WDQ6, 32MBIT; Manufacturer: Espressif Systems; Designed by: BERK; Supply Voltage-Nom: 3V3; Frequency: 2.5GHz; Data Rate: 150Mbps; Sensitivity: -98dBm; Operating Supply Voltage: 3.6V; RoHS: No; Max Operating Temperature: +85; Min Operating Temperature: -40; Supplier 1: Digi-Key; Manufacturer Part Number: ESP32-WROOM-32; Category: RF Receivers, Transceivers; Pricing 1: 1=3,80000 (USD); Mount: Surface Mount; Case/Package: SMD/SMT; Weight: 0.088185oz; Packaging: Cut Tape; Package Quantity: 550; ComponentLink1URL: https://datasheet.ciiva.com/70828/esp32-wroom-32-datasheet-en-70828769.pdf?src-supplier=Digi-Key; ComponentLink1Description: https://datasheet.ciiva.com/70828/esp32-wroom-32-datasheet-en-70828769.pdf?src-supplier=Digi-Key; ComponentLink2URL: https://datasheet.ciiva.com/69725/esp32-datasheet-en-69725253.pdf?src-supplier=Digi-Key; ComponentLink2Description: https://datasheet.ciiva.com/69725/esp32-datasheet-en-69725253.pdf?src-supplier=Digi-Key; Supplier Part Number 1: 1904-1010-1-ND
X1 = CRYSTAL 32768kHZ: Crystal, 32.768 kHz, SMD, 1.6mm x 1mm, 12.5 pF, 20 ppm, ABS05 Series; Manufacturer: Abracon; Frequency Tolerance: 20ppm; Load Capacitance: 12.5pF; ESR (Equivalent Series Resistance): 90kR; Designed by: BERK; Supplier 1: Digi-Key; Manufacturer Part Number: ABS05-32.768KHZ-T; RoHS: Yes; Category: Crystals; Stock 1: 180522; Pricing 1: 1=1,16000, 10=1,02500, 50=0,95760, 100=0,84630, 500=0,80180, 1000=0,66816 (USD); Mount: Surface Mount; Case/Package: SMD/SMT; Number of Pins: 2; Min Operating Temperature: -40°C; Max Operating Temperature: 85°C; Packaging: Tape and Reel; Package Quantity: 3000; Frequency: 32.768kHz; Tolerance: 20ppm; Termination: SMD/SMT; Series Resistance: 90kR; Series: ABS05; Length: 1.6mm; Width: 0.039inch; Height: 0.02inch; Depth: 1mm; Radiation Hardening: No; REACH SVHC: No SVHC; Lead Free: Lead Free; RoHS Compliant: Yes; ComponentLink1URL: https://datasheet.ciiva.com/23810/abs05-23810480.pdf?src-supplier=Newark; ComponentLink1Description: https://datasheet.ciiva.com/23810/abs05-23810480.pdf?src-supplier=Newark; ComponentLink2URL: https://datasheet.ciiva.com/6728/abs05-6728949.pdf?src-supplier=Digi-Key; ComponentLink2Description: https://datasheet.ciiva.com/6728/abs05-6728949.pdf?src-supplier=Digi-Key; ComponentLink3URL: https://datasheet.ciiva.com/6728/abs05-6728950.pdf?src-supplier=Digi-Key; ComponentLink3Description: https://datasheet.ciiva.com/6728/abs05-6728950.pdf?src-supplier=Digi-Key; ComponentLink4URL: https://datasheet.ciiva.com/16411/abs05-16411149.pdf?src-supplier=Future+Electronics; ComponentLink4Description: https://datasheet.ciiva.com/16411/abs05-16411149.pdf?src-supplier=Future+Electronics; Supplier Part Number 1: 535-11899-1-ND
X2 = CRYSTAL 16MHz: CRYSTAL 16.0000MHZ 20PF SMD; Manufacturer: ECS International; Designed by: BERK; Frequency Tolerance: 30ppm; ESR (Equivalent Series Resistance): 50R; Frequency Stability: 50ppm; Supplier 1: Digi-Key; Manufacturer Part Number: ECS-160-20-30B-TR; RoHS: Yes; Category: Crystals; Stock 1: 15303; Pricing 1: 1=1,33000, 10=1,26800, 50=1,23900, 100=1,06200, 500=1,03250 (USD); Mount: Surface Mount; Case/Package: SMD/SMT; Min Operating Temperature: -20°C; Max Operating Temperature: 70°C; Package Quantity: 1; Load Capacitance: 20pF; Packaging: Tape and Reel; Tolerance: 50ppm; Termination: SMD/SMT; Series: ECX-53B; Length: 0.197inch; Width: 0.126inch; Height: 0.033inch; Lead Free: Lead Free; RoHS Compliant: Yes; ComponentLink1URL: https://datasheet.ciiva.com/853/ecx-53b-853408.pdf?src-supplier=Digi-Key; ComponentLink1Description: https://datasheet.ciiva.com/853/ecx-53b-853408.pdf?src-supplier=Digi-Key; ComponentLink2URL: https://datasheet.ciiva.com/853/ecx-53b-853406.pdf?src-supplier=Digi-Key; ComponentLink2Description: https://datasheet.ciiva.com/853/ecx-53b-853406.pdf?src-supplier=Digi-Key; ComponentLink3URL: https://datasheet.ciiva.com/853/ecx-53b-853407.pdf?src-supplier=Digi-Key; ComponentLink3Description: https://datasheet.ciiva.com/853/ecx-53b-853407.pdf?src-supplier=Digi-Key; Supplier Part Number 1: XC1120CT-ND